# Altium project wb-cc2652p2.PrjPcb
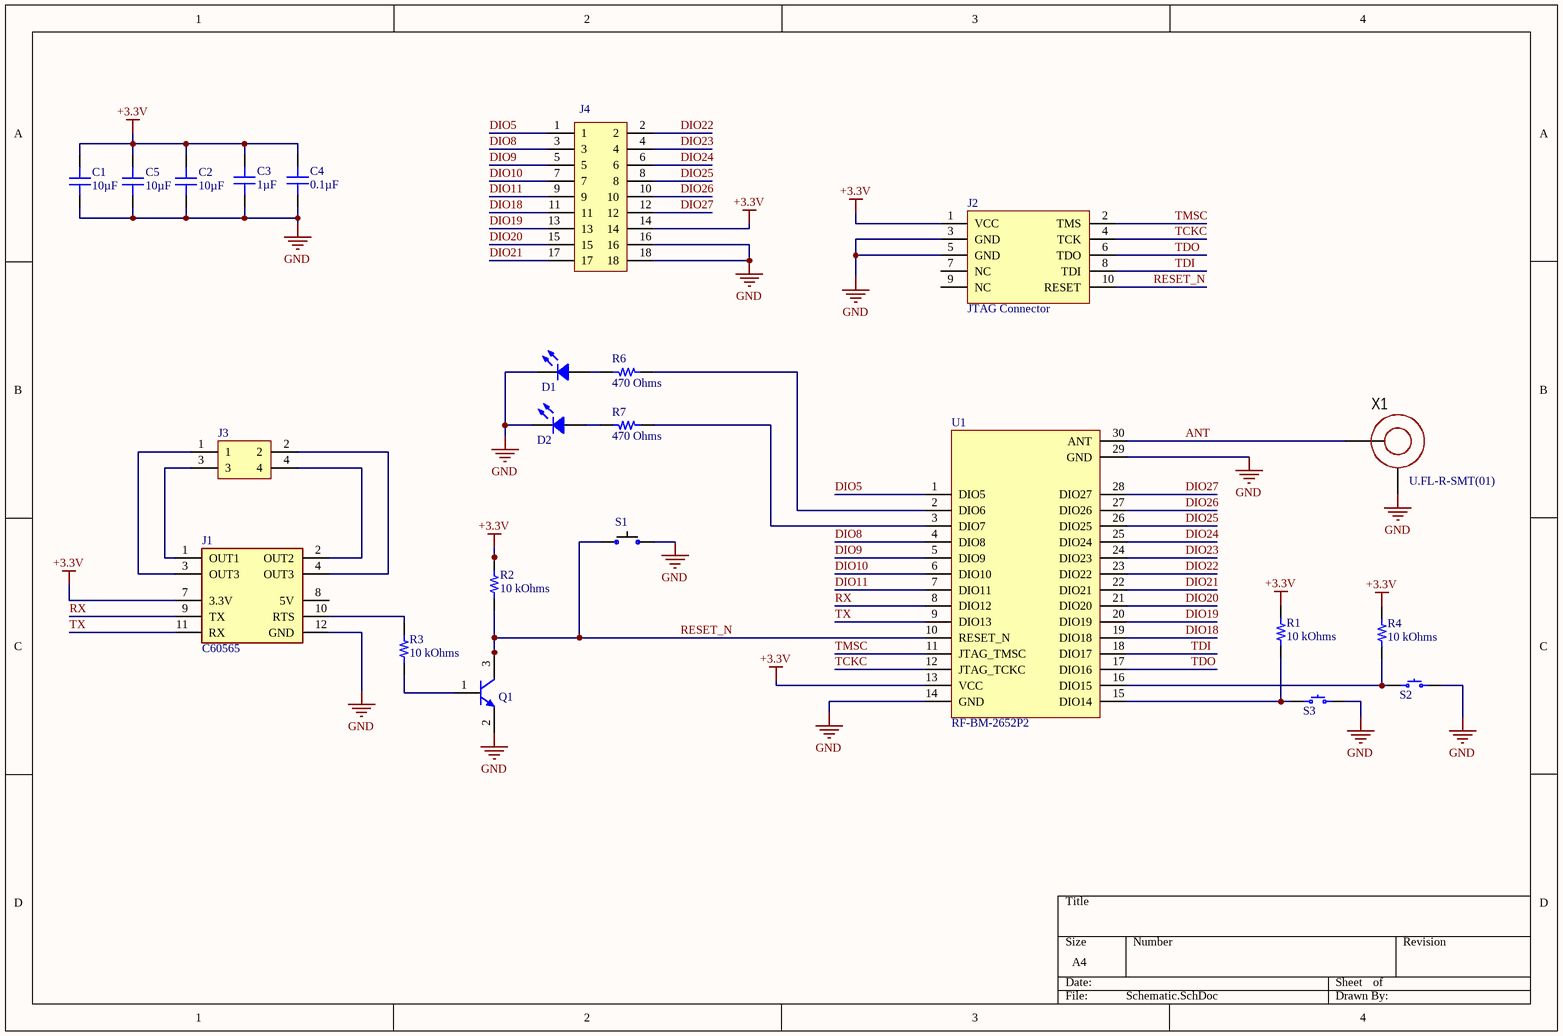
[diagram p0: Schematic.SchDoc]
1 sheet, 23 parts. Net scope: global (net labels, ports and power ports of the same name join across sheets).
Board file: PCB.PcbDoc

## Sheet Schematic.SchDoc
size A4

### Parts
C1  10µF  [CAP 0603_1608]
C2  10µF  [CAP 0603_1608]
C3  1µF  [CAP 0603_1608]
C4  0.1µF  [CAP 0603_1608]
C5  10µF  [CAP 0603_1608]
D1  Green  [LED 0603_1608 GREEN]  (value not drawn)
D2  Red  [LED 0603_1608 RED]  (value not drawn)
J1  C60565  [C60565]
J2  JTAG Connector  [2x1.27x10]
J3  Pins  [1.27x4]  (value not drawn)
J4  GPIO  [1.27x18]  (value not drawn)
Q1  BC847CLT1G  [ON SEMI SOT-23-3]  (value not drawn)
R1  10 kOhms  [RES 0603_1608]
R2  10 kOhms  [RES 0603_1608]
R3  10 kOhms  [RES 0603_1608]
R4  10 kOhms  [RES 0603_1608]
R6  470 Ohms  [RES 0603_1608]
R7  470 Ohms  [RES 0603_1608]
S1  K2-1107ST-A3SW-06  [Btn]  (value not drawn)
S2  KSS331GLFS  [C&K KSS]  (value not drawn)
S3  KSS331GLFS  [C&K KSS]  (value not drawn)
U1  RF-BM-2652P2  [RF-BM-2652P2]
X1  U.FL-R-SMT(01)  [CON: u.Fl]

### Nets
+3.3V: C1.1 C2.1 C3.1 C4.2 C5.1 J1.7(3.3V) J2.1(VCC) J4.14 R1.1 R2.1 R4.1 U1.13(VCC)
GND: C1.2 C2.2 C3.2 C4.1 C5.2 D1.2 D2.2 J1.12(GND) J2.3(GND) J2.5(GND) J4.16 J4.18 Q1.2(E) S1.2 S2.2 S3.2 U1.14(GND) U1.29(GND) X1.2
ANT: U1.30(ANT) X1.1
DIO5: J4.1 U1.1(DIO5)
DIO8: J4.3 U1.4(DIO8)
DIO9: J4.5 U1.5(DIO9)
DIO10: J4.7 U1.6(DIO10)
DIO11: J4.9 U1.7(DIO11)
DIO18: J4.11 U1.19(DIO18)
DIO19: J4.13 U1.20(DIO19)
DIO20: J4.15 U1.21(DIO20)
DIO21: J4.17 U1.22(DIO21)
DIO22: J4.2 U1.23(DIO22)
DIO23: J4.4 U1.24(DIO23)
DIO24: J4.6 U1.25(DIO24)
DIO25: J4.8 U1.26(DIO25)
DIO26: J4.10 U1.27(DIO26)
DIO27: J4.12 U1.28(DIO27)
RESET_N: J2.10(RESET) Q1.3(C) R2.2 S1.1 U1.10(RESET_N)
RX: J1.9(TX) U1.8(DIO12)
TCKC: J2.4(TCK) U1.12(JTAG_TCKC)
TDI: J2.8(TDI) U1.18(DIO17)
TDO: J2.6(TDO) U1.17(DIO16)
TMSC: J2.2(TMS) U1.11(JTAG_TMSC)
TX: J1.11(RX) U1.9(DIO13)
NetD1_1: D1.1 R6.1
NetD2_1: D2.1 R7.1
NetJ1_1: J1.1(OUT1) J3.3
NetJ1_2: J1.2(OUT2) J3.4
NetJ1_3: J1.3(OUT3) J3.1
NetJ1_4: J1.4(OUT3) J3.2
NetJ1_10: J1.10(RTS) R3.1
NetQ1_1: Q1.1(B) R3.2
NetR1_2: R1.2 S3.1 U1.15(DIO14)
NetR4_2: R4.2 S2.1 U1.16(DIO15)
NetR6_2: R6.2 U1.2(DIO6)
NetR7_2: R7.2 U1.3(DIO7)

Not connected (* = marked no-connect by the designer): J1 8(5V); J2 7(NC) 9(NC)

### Library data of the parts
C1 C2 C5 = GRM188R60J106ME47D: CAP CER 10UF 6.3V X5R 0603; Manufacturer: Murata Electronics; Tolerance: ±20%; Applications: General Purpose; Capacitance: 10µF; ComponentLink1Description: Datasheet; ComponentLink1URL: https://www.murata.com/~/media/webrenewal/support/library/catalog/products/capacitor/mlcc/c02e.ashx?la=en-us; ComponentLink2Description: DigiKey Link; ComponentLink2URL: http://digikey.com/product-detail/en/murata-electronics/GRM188R60J106ME47D/490-3896-1-ND/965938; Device Package: 0603 (1608 Metric); LastUpdated: 2020-09-02 01:03:35.500000; Lifecycle Status: Active; Part Number: GRM188R60J106ME47D; Minimum Order: 1; Mounting Type: Surface Mount, MLCC; Operating Temperature: -55°C ~ 85°C; Package / Case: 0603 (1608 Metric); Packaging: TapeAndReel; PartId: 2351; Part Status: Active; Price: 0.03; Series: GRM; Size / Dimension: 0.063 L x 0.031 W (1.60mm x 0.80mm); Supplier 1: DigiKey; Supplier Part Number 1: 490-3896-1-ND; Temperature Coefficient: X5R; Thickness (Max): 0.035 (0.90mm); Value: 10µF; Voltage - Rated: 6.3V
C3 = GCM188R71C105KA64D: CAP CER 1UF 16V X7R 0603; Manufacturer: Murata Electronics; Tolerance: ±10%; Applications: Automotive; Capacitance: 1µF; ComponentLink1Description: Datasheet; ComponentLink1URL: https://www.murata.com/~/media/webrenewal/support/library/catalog/products/capacitor/mlcc/c03e.ashx?la=en-us; ComponentLink2Description: DigiKey Link; ComponentLink2URL: http://digikey.com/product-detail/en/murata-electronics/GCM188R71C105KA64D/490-5241-1-ND/1979252; Device Package: 0603 (1608 Metric); LastUpdated: 2020-09-02 01:03:17.027000; Lifecycle Status: Active; Part Number: GCM188R71C105KA64D; Minimum Order: 1; Mounting Type: Surface Mount, MLCC; Operating Temperature: -55°C ~ 125°C; Package / Case: 0603 (1608 Metric); Packaging: TapeAndReel; PartId: 12672; Part Status: Active; Price: 0.04; Ratings: AEC-Q200; Series: GCM; Size / Dimension: 0.063 L x 0.031 W (1.60mm x 0.80mm); Supplier 1: DigiKey; Supplier Part Number 1: 490-5241-1-ND; Temperature Coefficient: X7R; Thickness (Max): 0.035 (0.90mm); Value: 1µF; Voltage - Rated: 16V
C4 = GCJ188R71C104KA01D: CAP CER 0.1UF 16V X7R 0603; Manufacturer: Murata Electronics; Tolerance: ±10%; Applications: Automotive, Boardflex Sensitive; Capacitance: 0.1µF; ComponentLink1Description: Datasheet; ComponentLink1URL: https://www.murata.com/~/media/webrenewal/support/library/catalog/products/capacitor/mlcc/c03e.ashx?la=en-us; ComponentLink2Description: DigiKey Link; ComponentLink2URL: http://digikey.com/product-detail/en/murata-electronics/GCJ188R71C104KA01D/490-5796-1-ND/2783830; Device Package: 0603 (1608 Metric); Features: Soft Termination; LastUpdated: 2020-09-02 01:03:00.960000; Lifecycle Status: Active; Part Number: GCJ188R71C104KA01D; Minimum Order: 1; Mounting Type: Surface Mount, MLCC; Operating Temperature: -55°C ~ 125°C; Package / Case: 0603 (1608 Metric); Packaging: TapeAndReel; PartId: 17928; Part Status: Active; Price: 0.05; Ratings: AEC-Q200; Series: GCJ; Size / Dimension: 0.063 L x 0.031 W (1.60mm x 0.80mm); Supplier 1: DigiKey; Supplier Part Number 1: 490-5796-1-ND; Temperature Coefficient: X7R; Thickness (Max): 0.035 (0.90mm); Value: 0.1µF; Voltage - Rated: 16V
D1 = APT1608CGCK: LED GREEN CLEAR CHIP SMD; Manufacturer: Kingbright; Configuration: Standard; Current - Test: 20mA; Lens Color: Colorless; Lens Size: 1.20mm x 0.80mm; Lens Style: Rectangle with Flat Top; Millicandela Rating: 50mcd; Viewing Angle: 120°; Voltage - Forward (Vf) (Typ): 2.1V; Wavelength - Dominant: 570nm; Wavelength - Peak: 574nm; Color: Green; ComponentLink1Description: Datasheet; ComponentLink1URL: http://www.kingbrightusa.com/images/catalog/SPEC/APT1608CGCK.pdf; ComponentLink2Description: DigiKey Link; ComponentLink2URL: http://digikey.com/product-detail/en/kingbright/APT1608CGCK/754-1116-1-ND/1747833; Device Package: 0603 (1608 Metric); Height (Max): 0.75mm; LastUpdated: 2020-09-02 01:20:41.777000; Lens Transparency: Clear; Lifecycle Status: Active; Part Number: APT1608CGCK; Minimum Order: 1; Mounting Type: Surface Mount; Package / Case: 0603 (1608 Metric); Packaging: TapeAndReel; PartId: 664; Part Status: Active; Price: 0.07; Series: -; Size / Dimension: 1.60mm L x 0.80mm W; Supplier 1: DigiKey; Supplier Part Number 1: 754-1116-1-ND; Supplier Device Package: Chip LED; Value: Green
D2 = APT1608EC: LED RED CLEAR CHIP SMD; Manufacturer: Kingbright; Configuration: Standard; Current - Test: 20mA; Lens Color: Colorless; Lens Size: 1.20mm x 0.80mm; Lens Style: Rectangle with Flat Top; Millicandela Rating: 8mcd; Viewing Angle: 120°; Voltage - Forward (Vf) (Typ): 2V; Wavelength - Dominant: 617nm; Wavelength - Peak: 627nm; Color: Red; ComponentLink1Description: Datasheet; ComponentLink1URL: http://www.kingbrightusa.com/images/catalog/SPEC/APT1608EC.pdf; ComponentLink2Description: DigiKey Link; ComponentLink2URL: http://digikey.com/product-detail/en/kingbright/APT1608EC/754-1117-1-ND/1747834; Device Package: 0603 (1608 Metric); Height (Max): 0.75mm; LastUpdated: 2020-09-02 01:20:55.660000; Lens Transparency: Clear; Lifecycle Status: Active; Part Number: APT1608EC; Minimum Order: 1; Mounting Type: Surface Mount; Package / Case: 0603 (1608 Metric); Packaging: TapeAndReel; PartId: 458; Part Status: Active; Price: 0.06; Series: -; Size / Dimension: 1.60mm L x 0.80mm W; Supplier 1: DigiKey; Supplier Part Number 1: 754-1117-1-ND; Supplier Device Package: Chip LED; Value: Red
J1 = C60565: / Pin Header 12 2 right-angle，90degrees 2.54mm P=2.54mm Pin Header & Female Header RoHS; MF: Global Connector Technology; MP: BG040-14-A-0300-0300-N-G; Value: *; Package: None; Check_prices: https://www.snapeda.com/parts/BG040-14-A-0300-0300-N-G/Global%20Connector%20Technology/view-part/2751851/?ref=eda; SnapEDA_Link: https://www.snapeda.com/parts/BG040-14-A-0300-0300-N-G/Global%20Connector%20Technology/view-part/2751851/?ref=snap; Price: None; Availability: Unavailable
Q1 = BC847CLT1G: TRANS NPN 45V 0.1A SOT23; Manufacturer: ON Semiconductor; Current - Collector Cutoff (Max): 15nA (ICBO); Current - Collector (Ic) (Max): 100mA; DC Current Gain (hFE) (Min) @ Ic, Vce: 420 @ 2mA, 5V; Frequency - Transition: 100MHz; Power - Max: 300mW; Vce Saturation (Max) @ Ib, Ic: 600mV @ 5mA, 100mA; ComponentLink1Description: Datasheet; ComponentLink1URL: http://www.onsemi.com/pub/Collateral/BC846ALT1-D.PDF; ComponentLink2Description: DigiKey Link; ComponentLink2URL: http://digikey.com/product-detail/en/on-semiconductor/BC847CLT1G/BC847CLT1GOSCT-ND/917836; LastUpdated: 2020-09-02 01:30:09.047000; Lifecycle Status: Active; Part Number: BC847CLT1G; Minimum Order: 1; Mounting Type: Surface Mount; Operating Temperature: -55°C ~ 150°C (TJ); Package / Case: TO-236-3, SC-59, SOT-23-3; Packaging: TapeAndReel; PartId: 252; Part Status: Active; Price: 0.02; Series: -; Supplier 1: DigiKey; Supplier Part Number 1: BC847CLT1GOSCT-ND; Supplier Device Package: SOT-23-3 (TO-236); Transistor Type: NPN; Voltage - Collector Emitter Breakdown (Max): 45V
R1-R4 = RT0603DRD0710KL: RES SMD 10K OHM 0.5% 1/10W 0603; Manufacturer: Yageo; Power (Watts): 0.1W, 1/10W; Temperature Coefficient: ±25ppm/°C; Part Number: RT0603DRD0710KL; ComponentLink1Description: Datasheet; ComponentLink1URL: https://www.yageo.com/upload/media/product/productsearch/datasheet/rchip/PYu-RT_1-to-0.01_RoHS_L_11.pdf; ComponentLink2Description: DigiKey Link; ComponentLink2URL: http://digikey.com/product-detail/en/yageo/RT0603DRD0710KL/311-10KDCT-ND/1035680; Composition: Thin Film; Device Package: 0603 (1608 Metric); Height - Seated (Max): 0.022 (0.55mm); LastUpdated: 2020-09-02 01:10:23.407000; Lifecycle Status: Active; Minimum Order: 1; Number of Terminations: 2; Operating Temperature: -55°C ~ 155°C; Package / Case: 0603 (1608 Metric); Packaging: TapeAndReel; PartId: 5487; Part Status: Active; Price: 0.02; Resistance: 10 kOhms; Series: RT; Size / Dimension: 0.063 L x 0.031 W (1.60mm x 0.80mm); Supplier 1: DigiKey; Supplier Part Number 1: 311-10KDCT-ND; Supplier Device Package: 0603; Tolerance: ±0.5%; Value: 10 kOhms
R6 R7 = AT0603FRE07470RL: RES SMD 470 OHM 1% 1/10W 0603; Manufacturer: Yageo; Power (Watts): 0.1W, 1/10W; Temperature Coefficient: ±50ppm/°C; Part Number: AT0603FRE07470RL; ComponentLink1Description: Datasheet; ComponentLink1URL: http://www.yageo.com/documents/recent/PYu-AT_51_RoHS_L_5.pdf; ComponentLink2Description: DigiKey Link; ComponentLink2URL: http://digikey.com/product-detail/en/yageo/AT0603FRE07470RL/YAG2128CT-ND/5139576; Composition: Thin Film; Device Package: 0603 (1608 Metric); Features: Anti-Sulfur, Automotive AEC-Q200, Moisture Resistant; Height - Seated (Max): 0.022 (0.55mm); LastUpdated: 2020-09-02 01:10:20.073000; Lifecycle Status: Active; Minimum Order: 1; Number of Terminations: 2; Operating Temperature: -55°C ~ 155°C; Package / Case: 0603 (1608 Metric); Packaging: TapeAndReel; PartId: 7105; Part Status: Active; Price: 0.02; Ratings: AEC-Q200; Resistance: 470 Ohms; Series: AT; Size / Dimension: 0.063 L x 0.031 W (1.60mm x 0.80mm); Supplier 1: DigiKey; Supplier Part Number 1: YAG2128CT-ND; Supplier Device Package: 0603; Tolerance: ±1%; Value: 470 Ohms
S1 = Btn
S2 S3 = KSS331GLFS: SWITCH TACTILE SPST-NO 0.05A 50V; Manufacturer: C&K; Actuator Orientation: Side Actuated; Actuator Type: Rectangular Button; Contact Rating @ Voltage: 0.05A @ 50VDC; Illumination: Non-Illuminated; Ingress Protection: IP40; Operating Force: 250gf; Outline: 7.60mm x 3.70mm; Switch Function: Off-Mom; Part Number: KSS331GLFS; Circuit: SPST-NO; ComponentLink1Description: Datasheet; ComponentLink1URL: https://dznh3ojzb2azq.cloudfront.net/products/Tactile/KSS/documents/datasheet.pdf; ComponentLink2Description: DigiKey Link; ComponentLink2URL: http://digikey.com/product-detail/en/c-k/KSS331GLFS/401-1101-1-ND/417673; Features: Tactile Feedback; LastUpdated: 2020-04-09 09:55:46.287000; Lifecycle Status: Active; Minimum Order: 1; Mounting Type: Surface Mount, Right Angle; Operating Temperature: -40°C ~ 85°C; Packaging: TapeAndReel; Part Status: Active; Price: 0.35; Series: KSS; Supplier 1: DigiKey; Supplier Part Number 1: 401-1101-1-ND; Termination Style: Gull Wing
X1 = U.FL-R-SMT(01): Manufacturer: Hirose Electric; ValueManufacturerPartNumber: Connector u.FL, 50 Ohm, 6GHz; TypeConnector: Connector u.FL; Frequency: 6GHz; Impedance: 50 Ohm; HelpURL: https://www.digikey.com/product-detail/en/hirose-electric-co-ltd/U.FL-R-SMT-01/H9161-ND/513010; PartNumber: U.FL-R-SMT(01)